# EAGLE schematic ESP-12E (EAGLE 7.5.0)
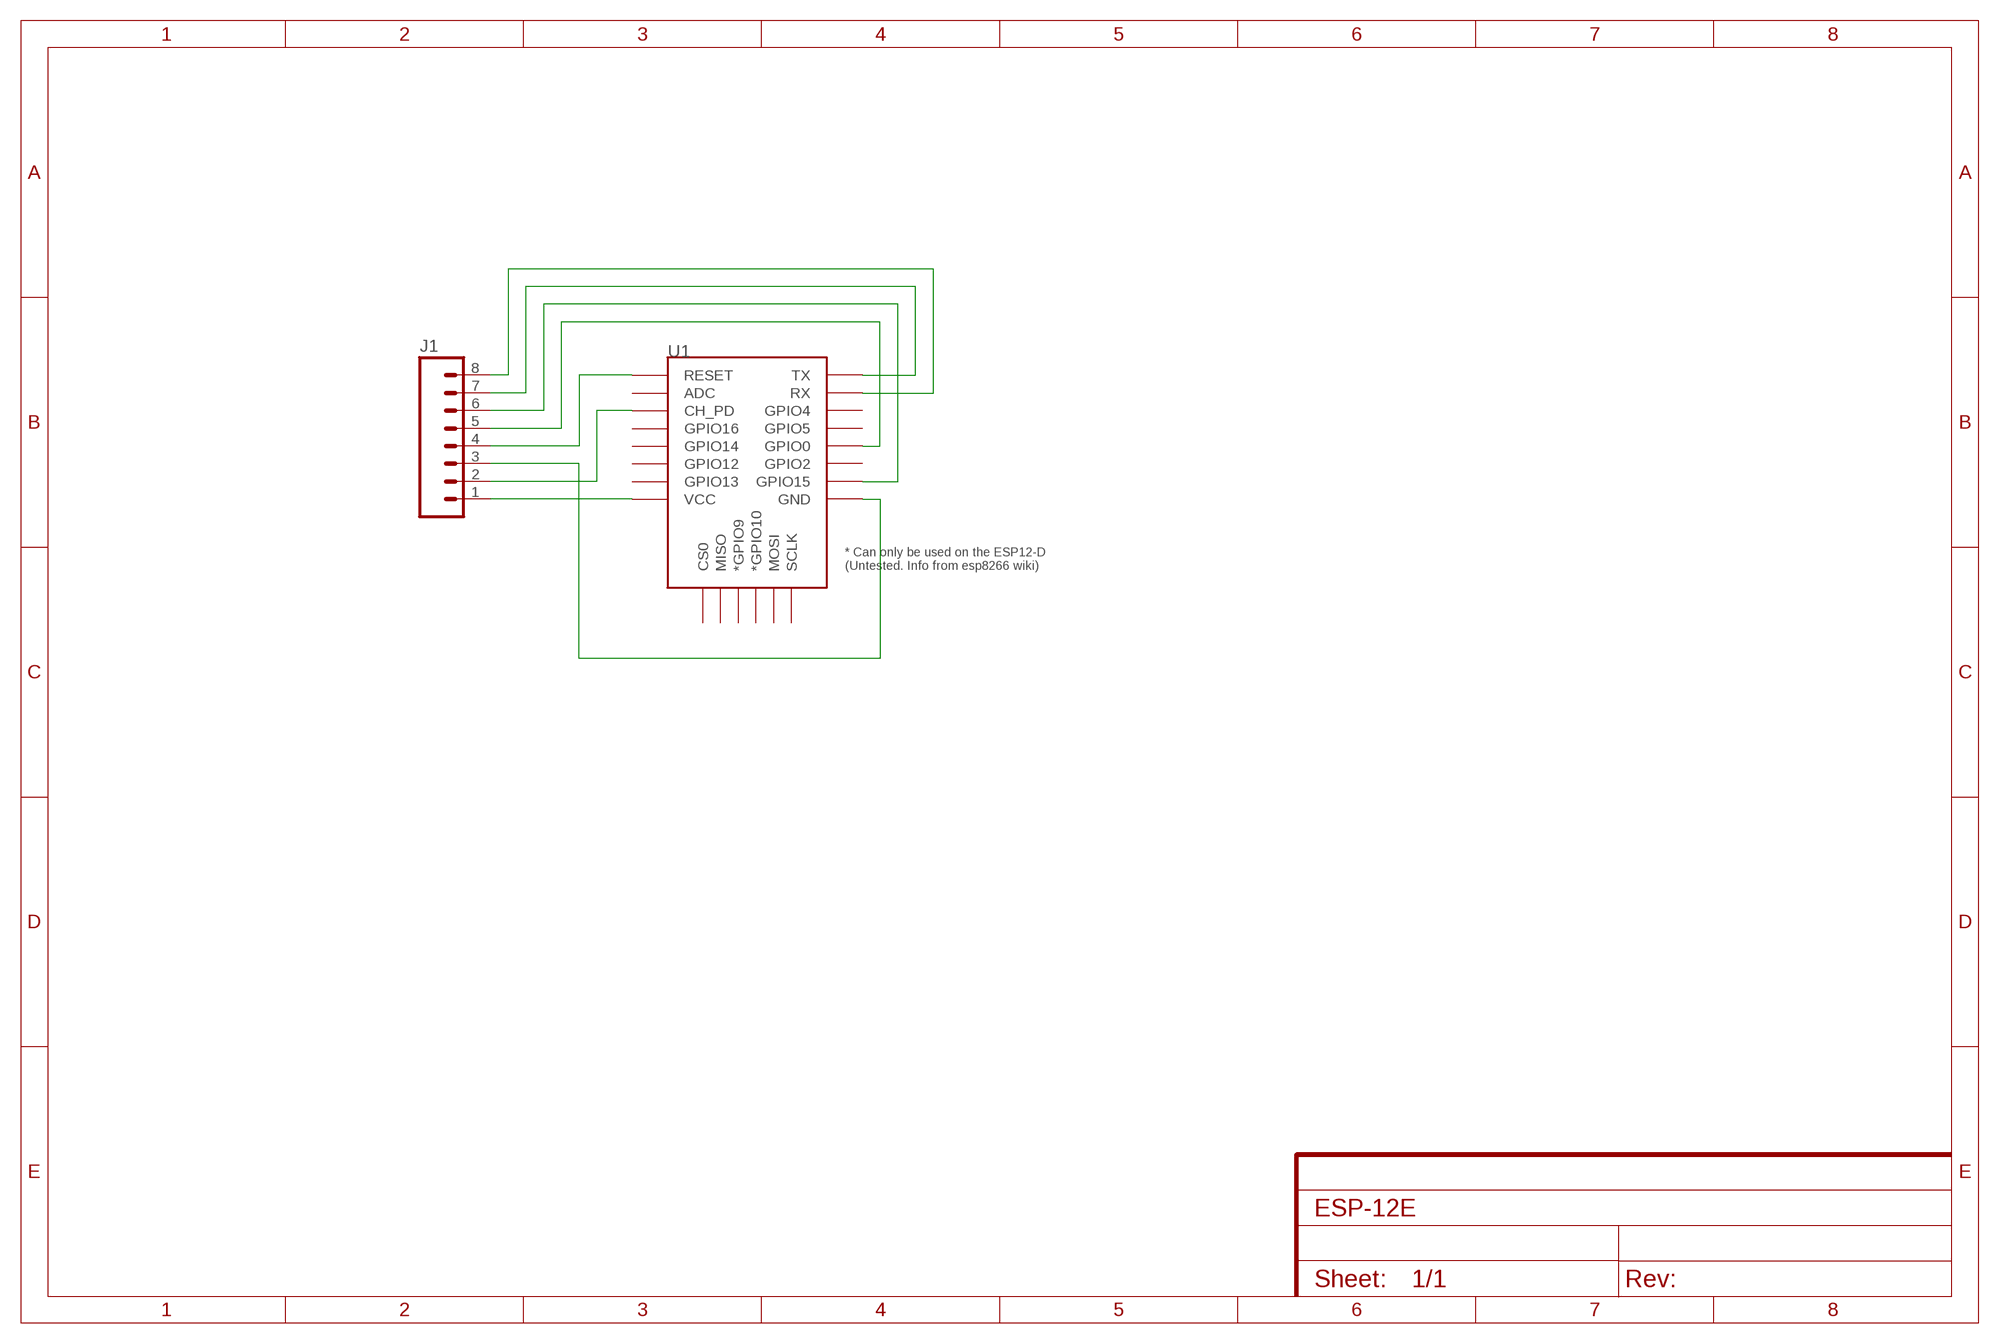
[diagram p0: schematic, sheet 1]

## Parts
J1  M08  [1X08_ROUND]
U1  ESP12ESMD  [ESP12E-SMD]

## Nets
EN: J1.2 U1.CH_PD
G0: J1.5 U1.GPIO0
G15: J1.6 U1.GPIO15
GND: J1.3 U1.GND
RST: J1.4 U1.RESET
RX: J1.8 U1.RXD0(RX)
TX: J1.7 U1.TXD0(TX)
VCC: J1.1 U1.VCC
Unconnected: U1.ADC U1.CS0 U1.GPIO2 U1.GPIO4 U1.GPIO5 U1.GPIO9(*GPIO9) U1.GPIO10(*GPIO10) U1.GPIO12 U1.GPIO13 U1.GPIO14 U1.GPIO16 U1.MISO U1.MOSI U1.SCLK

## Library data of the parts
J1 = SparkFun-Connectors:M08: Header 8 Standard 8-pin 0.1" header. Use with straight break away headers (SKU : PRT-00116), right angle break away headers (PRT-00553), swiss pins (PRT-00743), machine pins (PRT-00117), and female headers (PRT-00115).; PROD_ID: CONN-08437
U1 = esp8266modules:ESP12E: ESP12E Module